# EAGLE design VeloPuter (EAGLE 8.5.0)
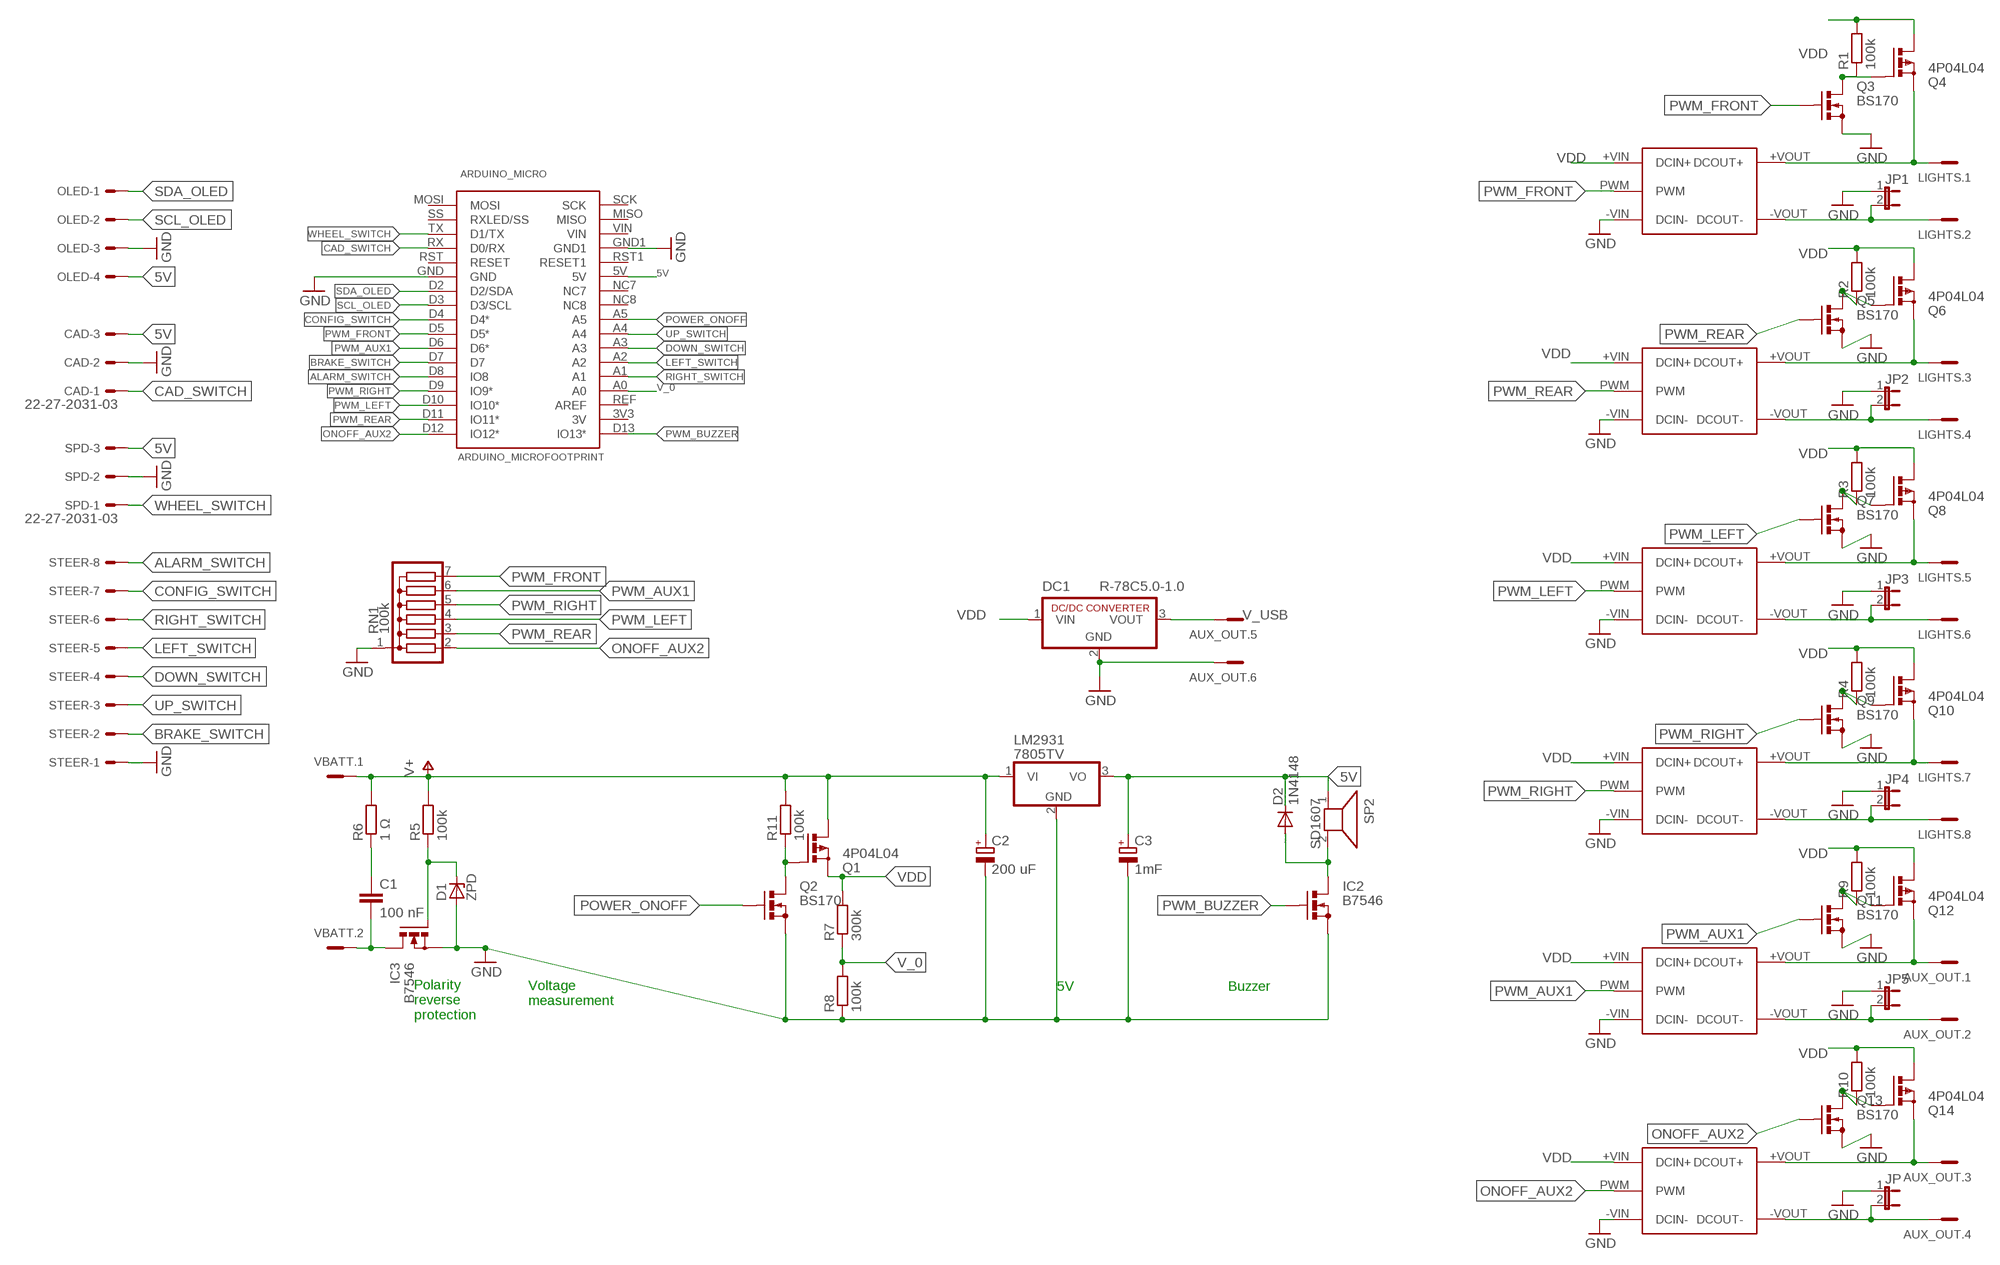
[diagram p0: schematic, sheet 1]

## Parts
ARDUINO_MICRO  ARDUINO_MICROFOOTPRINT  [ARDUINO-MICRO]
AUX_OUT  Aux  MCV6  [MCV6]
BRAKE  LDD-L  [LDD-L]
C1  100 nF  C2,5-3  [C2.5-3]
C2  200 uF  CPOL-EUE5-10.5  [E5-10,5]
C3  1mF  CPOL-EUE5-10.5  [E5-10,5]
CAD  22-27-2031-03  [6410-03]
D1  ZPD  [DO35Z10]
D2  1N4148  1N4148DO35-7  [DO35-7]
DC1  R-78C5.0-1.0  [SIP3]
IC2  B7546  BS170  [SOT54E]
IC3  B7546  PMOSFET_NTO220BV  [TO220BV]
JP  JP1E  [JP1]
JP1  JP1E  [JP1]
JP2  JP1E  [JP1]
JP3  JP1E  [JP1]
JP4  JP1E  [JP1]
JP5  JP1E  [JP1]
LIGHTS  Lights  MCV8  [MCV8]
LM2931  7805TV  [TO220V]
OLED  22-27-2041-04  [6410-04]
Q1  4P04L04  PMOSFET_PTO220BV  [TO220BV]
Q2  BS170  [SOT54E]
Q3  BS170  [SOT54E]
Q4  4P04L04  PMOSFET_PTO220BV  [TO220BV]
Q5  BS170  [SOT54E]
Q6  4P04L04  PMOSFET_PTO220BV  [TO220BV]
Q7  BS170  [SOT54E]
Q8  4P04L04  PMOSFET_PTO220BV  [TO220BV]
Q9  BS170  [SOT54E]
Q10  4P04L04  PMOSFET_PTO220BV  [TO220BV]
Q11  BS170  [SOT54E]
Q12  4P04L04  PMOSFET_PTO220BV  [TO220BV]
Q13  BS170  [SOT54E]
Q14  4P04L04  PMOSFET_PTO220BV  [TO220BV]
R1  100k  R-EU_0207/10  [0207/10]
R2  100k  R-EU_0207/10  [0207/10]
R3  100k  R-EU_0207/10  [0207/10]
R4  100k  R-EU_0207/10  [0207/10]
R5  100k  R-EU_0207/10  [0207/10]
R6  1 Ω  R-EU_0207/10  [0207/10]
R7  300k  R-EU_0207/10  [0207/10]
R8  100k  R-EU_0207/10  [0207/10]
R9  100k  R-EU_0207/10  [0207/10]
R10  100k  R-EU_0207/10  [0207/10]
R11  100k  R-EU_0207/10  [0207/10]
RN1  100k  G06R  [SIL7]
SP2  SD1607  AL60P  [AL60P]
SPD  22-27-2031-03  [6410-03]
STEER  22-27-2081-08  [6410-08]
U$1  LDD-L  [LDD-L]
U$2  LDD-L  [LDD-L]
U$3  LDD-L  [LDD-L]
U$4  LDD-L  [LDD-L]
U$5  LDD-L  [LDD-L]
VBATT  MCV2  [MCV2]

## Nets
5V: ARDUINO_MICRO.5V C3.+ CAD.3 D2.C LM2931.3(VO) OLED.4 SP2.1 SPD.3
ALARM_SWITCH: ARDUINO_MICRO.D8(IO8) STEER.8
AUX1+: AUX_OUT.1 Q12.S U$5.+VOUT(DCOUT+)
AUX1-: AUX_OUT.2 JP5.2 U$5.-VOUT(DCOUT-)
AUX2+: AUX_OUT.3 Q14.S U$1.+VOUT(DCOUT+)
AUX2-: AUX_OUT.4 JP.2 U$1.-VOUT(DCOUT-)
BRAKE_SWITCH: ARDUINO_MICRO.D7 STEER.2
CAD_SWITCH: ARDUINO_MICRO.RX(D0/RX) CAD.1
CONFIG_SWITCH: ARDUINO_MICRO.D4(D4*) STEER.7
DOWN_SWITCH: ARDUINO_MICRO.A3 STEER.4
FRONT+: LIGHTS.1 Q4.S U$4.+VOUT(DCOUT+)
FRONT-: JP1.2 LIGHTS.2 U$4.-VOUT(DCOUT-)
GND: ARDUINO_MICRO.GND ARDUINO_MICRO.GND1 AUX_OUT.6 BRAKE.-VIN(DCIN-) C2.- C3.- CAD.2 D1.A DC1.2(GND) IC2.S IC3.S JP1.1 JP2.1 JP3.1 JP4.1 JP5.1 JP.1 LM2931.2(GND) OLED.3 Q2.S Q3.S Q5.S Q7.S Q9.S Q11.S Q13.S R8.1 RN1.1 SPD.2 STEER.1 U$1.-VIN(DCIN-) U$2.-VIN(DCIN-) U$3.-VIN(DCIN-) U$4.-VIN(DCIN-) U$5.-VIN(DCIN-)
LEFT+: LIGHTS.5 Q8.S U$2.+VOUT(DCOUT+)
LEFT-: JP3.2 LIGHTS.6 U$2.-VOUT(DCOUT-)
LEFT_SWITCH: ARDUINO_MICRO.A2 STEER.5
N$1: C1.1 R6.1
N$4: D1.C IC3.G R5.1
N$14: D2.A IC2.D SP2.2
N$15: Q1.G Q2.D R11.1
N$17: Q3.D Q4.G R1.1
N$20: Q5.D Q6.G R2.1
N$23: Q7.D Q8.G R3.1
N$28: Q9.D Q10.G R4.1
N$33: Q11.D Q12.G R9.1
N$40: Q13.D Q14.G R10.1
ONOFF_AUX2: ARDUINO_MICRO.D12(IO12*) Q13.G RN1.2 U$1.PWM
POWER_ONOFF: ARDUINO_MICRO.A5 Q2.G
PWM_AUX1: ARDUINO_MICRO.D6(D6*) Q11.G RN1.6 U$5.PWM
PWM_BUZZER: ARDUINO_MICRO.D13(IO13*) IC2.G
PWM_FRONT: ARDUINO_MICRO.D5(D5*) Q3.G RN1.7 U$4.PWM
PWM_LEFT: ARDUINO_MICRO.D10(IO10*) Q7.G RN1.4 U$2.PWM
PWM_REAR: ARDUINO_MICRO.D11(IO11*) BRAKE.PWM Q5.G RN1.3
PWM_RIGHT: ARDUINO_MICRO.D9(IO9*) Q9.G RN1.5 U$3.PWM
REAR+: BRAKE.+VOUT(DCOUT+) LIGHTS.3 Q6.S
REAR-: BRAKE.-VOUT(DCOUT-) JP2.2 LIGHTS.4
RIGHT+: LIGHTS.7 Q10.S U$3.+VOUT(DCOUT+)
RIGHT-: JP4.2 LIGHTS.8 U$3.-VOUT(DCOUT-)
RIGHT_SWITCH: ARDUINO_MICRO.A1 STEER.6
SCL_OLED: ARDUINO_MICRO.D3(D3/SCL) OLED.2
SDA_OLED: ARDUINO_MICRO.D2(D2/SDA) OLED.1
UP_SWITCH: ARDUINO_MICRO.A4 STEER.3
V+: C2.+ LM2931.1(VI) Q1.D R5.2 R6.2 R11.2 VBATT.1
V-: C1.2 IC3.D VBATT.2
V_0: ARDUINO_MICRO.A0 R7.1 R8.2
V_USB: AUX_OUT.5 DC1.3(VOUT)
VDD: BRAKE.+VIN(DCIN+) DC1.1(VIN) Q1.S Q4.D Q6.D Q8.D Q10.D Q12.D Q14.D R1.2 R2.2 R3.2 R4.2 R7.2 R9.2 R10.2 U$1.+VIN(DCIN+) U$2.+VIN(DCIN+) U$3.+VIN(DCIN+) U$4.+VIN(DCIN+) U$5.+VIN(DCIN+)
WHEEL_SWITCH: ARDUINO_MICRO.TX(D1/TX) SPD.1
Unconnected: ARDUINO_MICRO.3V3(3V) ARDUINO_MICRO.MISO ARDUINO_MICRO.MOSI ARDUINO_MICRO.NC7 ARDUINO_MICRO.NC8 ARDUINO_MICRO.REF(AREF) ARDUINO_MICRO.RST1(RESET1) ARDUINO_MICRO.RST(RESET) ARDUINO_MICRO.SCK ARDUINO_MICRO.SS(RXLED/SS) ARDUINO_MICRO.VIN

## Notes on the sheet
- 5V | Buzzer
- Voltage
  measurement
- Polarity 
  reverse 
  protection

## Library data of the parts
ARDUINO_MICRO = arduino-micro_gbeu:ARDUINO_MICRO; OC_NEWARK: unknown
AUX_OUT = con-phoenix_3.81_mcv:MCV6: Mini-Combicon 3.81mm vertikal 6polig (ohne Gegenstecker)
BRAKE U$1-U$5 = meanwell_dcdc:LDD-L; OC_NEWARK: unknown
C1 = capacitor-wima:C: CAPACITOR naming: grid - package width; OC_NEWARK: unknown
C2 = rcl:CPOL-EU: POLARIZED CAPACITOR, European symbol; OC_NEWARK: unknown
C3 = resistor:CPOL-EU: POLARIZED CAPACITOR, European symbol; OC_NEWARK: unknown
CAD SPD = con-molex:22-?-03: CONNECTOR wire to board 2.54 mm (.1 inch) pitch header; OC_FARNELL: unknown; OC_NEWARK: unknown
D1 = diode:ZPD: Z DIODE 500 mW; OC_NEWARK: unknown
D2 = diode:1N4148: DIODE high speed (Philips); OC_NEWARK: unknown
DC1 = dc-dc-converter:R-78C*-1.0: INNOLINE DC/DC-Converter 1.0 AMP SIP3 Single Output Source: Data sheet <http://www.mikrocontroller.net/attachment/150645/157764-da-01-en-DC_DC_WANDLER_R_78C5_0_1_0.pdf>
IC2 = transistor-small-signal:BS170: N-CHANNEL MOS FET; OC_NEWARK: unknown
IC3 = transistor-power:PMOSFET_N: Power MOSFET N-Channel; OC_NEWARK: unknown
JP JP1-JP5 = jumper:JP1E: JUMPER
LIGHTS = con-phoenix_3.81_mcv:MCV8: Mini-Combicon 3.81mm vertikal 8polig (ohne Gegenstecker)
LM2931 = linear:78*: Positive VOLTAGE REGULATOR Source: http://cache.national.com/ds/LM/LM78L05.pdf http://www.fairchildsemi.com/ds/LM/LM7805.pdf
OLED = con-molex:22-?-04: CONNECTOR wire to board 2.54 mm (.1 inch) pitch header; OC_FARNELL: unknown; OC_NEWARK: unknown
Q1 Q4 Q6 Q8 Q10 Q12 Q14 = transistor-power:PMOSFET_P: Power MOSFET P-Channel
Q2 Q3 Q5 Q7 Q9 Q11 Q13 = transistor-small-signal:BS170: N-CHANNEL MOS FET
R1-R11 = resistor:R-EU_: RESISTOR, European symbol; OC_NEWARK: unknown
RN1 = resistor-sil:G06R: SIL RESISTOR; OC_FARNELL: unknown; OC_NEWARK: unknown
SP2 = TDK_SD1607:AL60P: SPEAKER Source: Buerklin
STEER = con-molex:22-?-08: CONNECTOR wire to board 2.54 mm (.1 inch) pitch header; OC_FARNELL: unknown; OC_NEWARK: unknown
VBATT = con-phoenix_3.81_mcv:MCV2: Mini-Combicon 3.81mm vertikal 2polig (ohne Gegenstecker)

## Net classes
0 default: width 0.305 mm, drill 0.508 mm, clearance 0.254 mm

## Board
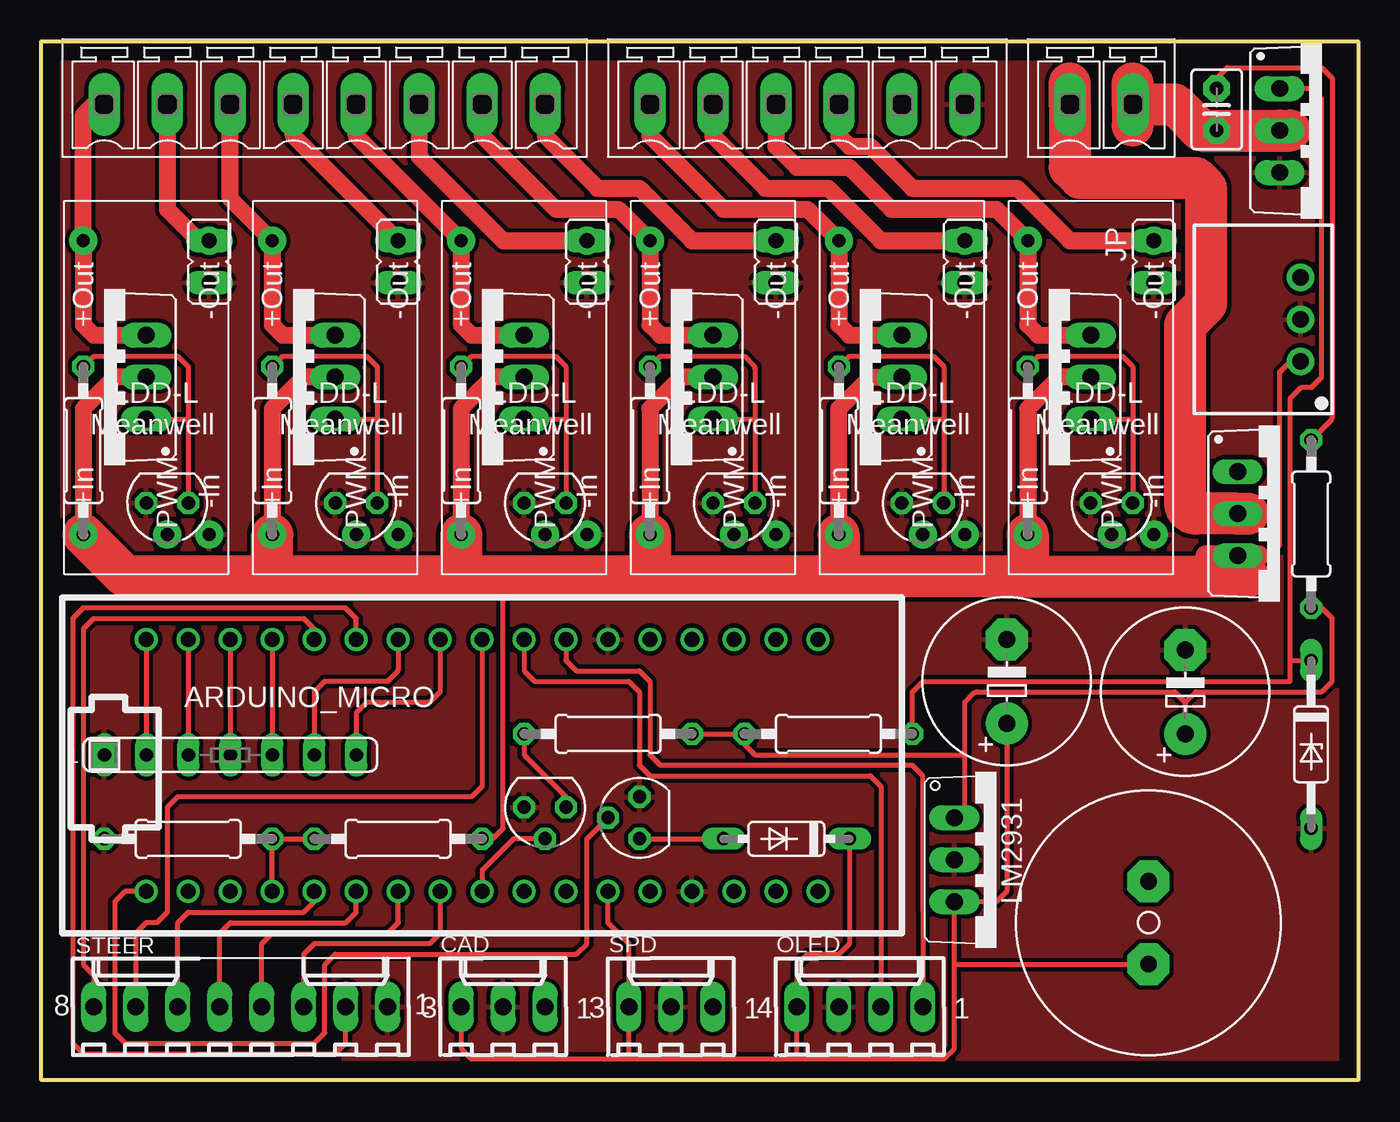
[diagram p1: board, top side]
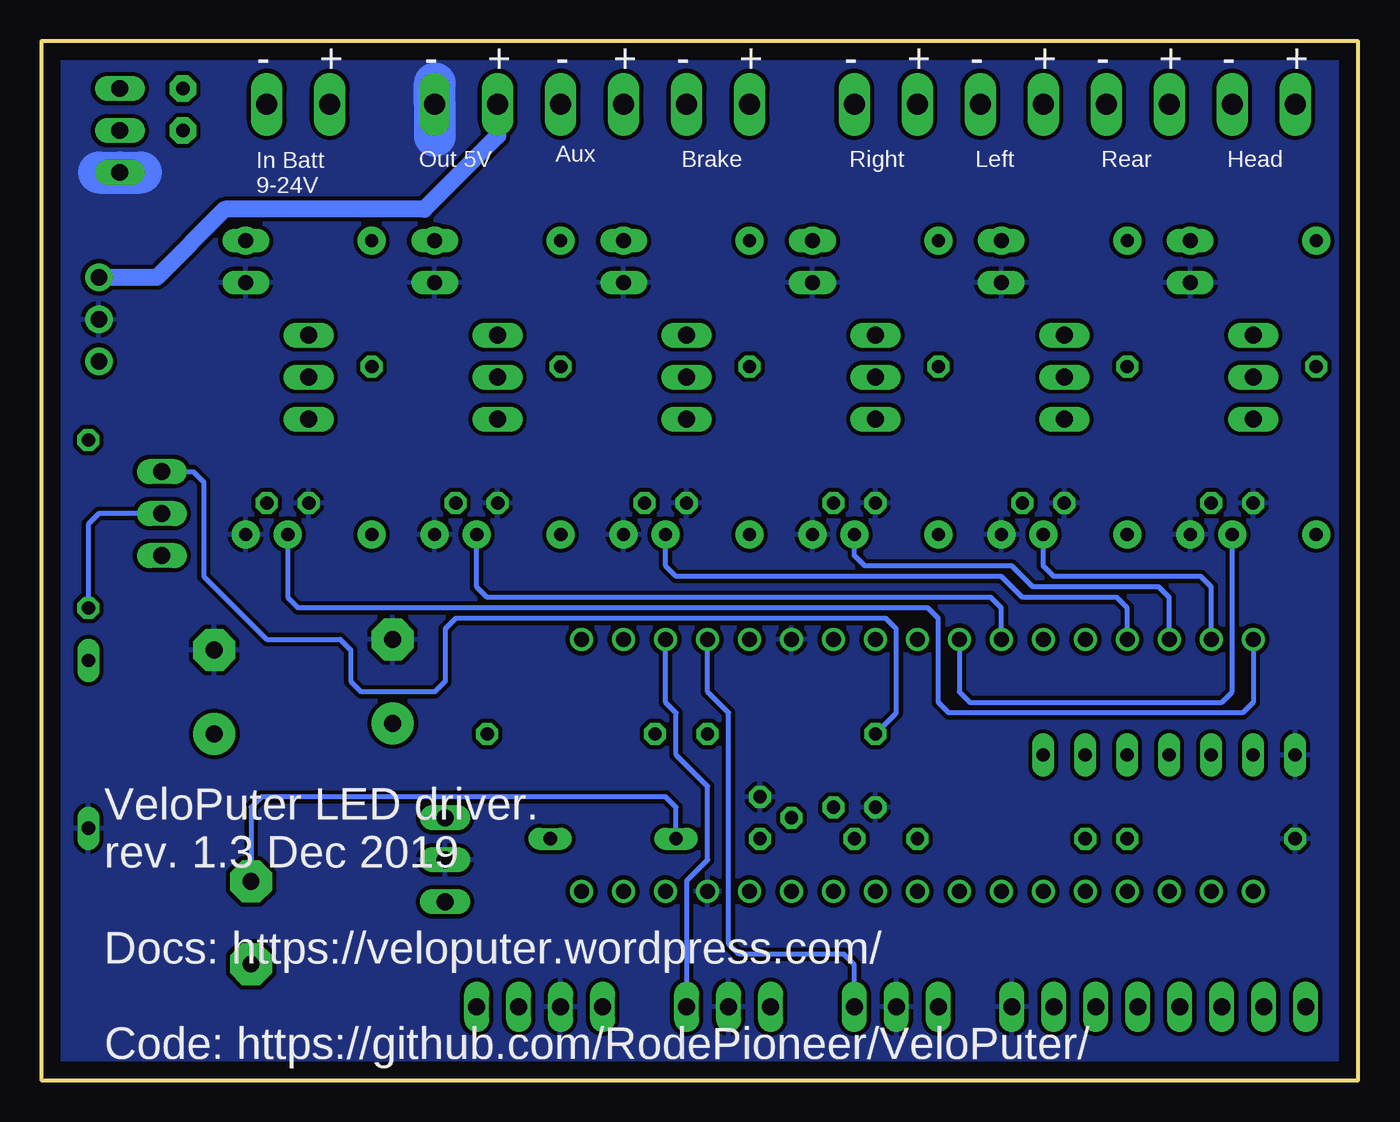
[diagram p2: board, bottom side, seen from below]

Size 79.68 x 62.85 mm. Coordinates in mm from the lower left corner, seen from the top.
Outline: 0,0 0,62.85 79.68,62.85 79.68,0 0,0
Copper layers (1*16): Top 0.035mm / dielectric 1.5mm / Bottom 0.035mm
Design rules "velomobiel_verlichting *": minimum track width 10mil, minimum drill 24mil, track to track 0.205mm, track to pad 0.205mm, pad to pad 0.205mm, via to via 0.205mm, smd to smd 8mil, copper to edge 40mil, drill to drill 8mil, minimum pad ring 10mil, minimum via ring 8mil, stop-mask expansion 4mil, vias tented up to drill 0mil, thermal gap 10mil

### Footprints (pad centres in the part's own frame; a part is rotated, then mirrored left to right if it is on the bottom)
ARDUINO-MICRO = drill 0.9: 3V3 16.51,3.81; 5V 16.51,29.21; A0 16.51,8.89; A1 16.51,11.43; A2 16.51,13.97; A3 16.51,16.51; A4 16.51,19.05; A5 16.51,21.59; D2 1.27,26.67; D3 1.27,24.13; D4 1.27,21.59; D5 1.27,19.05; D6 1.27,16.51; D7 1.27,13.97; D8 1.27,11.43; D9 1.27,8.89; D10 1.27,6.35; D11 1.27,3.81; D12 1.27,1.27; D13 16.51,1.27; GND 1.27,29.21; GND1 16.51,34.29; MISO 16.51,39.37; MOSI 1.27,41.91; NC7 16.51,26.67; NC8 16.51,24.13; REF 16.51,6.35; RST 1.27,31.75; RST1 16.51,31.75; RX 1.27,34.29; SCK 16.51,41.91; SS 1.27,39.37; TX 1.27,36.83; VIN 16.51,36.83
MCV6 = drill 1.27 pad 1.905 long: 1 -9.525,0; 2 -5.715,0; 3 -1.905,0; 4 1.905,0; 5 5.715,0; 6 9.525,0
LDD-L = drill 0.8 pad 1.676: +VIN 3.81,8.89; +VOUT 3.81,-8.89; -VIN -3.81,8.89; -VOUT -3.81,-8.89; PWM -1.27,8.89
C2.5-3 = drill 0.813 pad 1.6 octagon: 1 -1.27,0; 2 1.27,0
E5-10,5 = drill 1.016 pad 2.54: + -2.54,0 | drill 1.016 pad 2.54 octagon: - 2.54,0
6410-03 = drill 1.016 long: 1 2.54,0; 2 0,0; 3 -2.54,0
DO35Z10 = drill 0.813 long: A 5.08,0; C -5.08,0
DO35-7 = drill 0.813 long: A 3.81,0; C -3.81,0
SIP3 = drill 1 pad 1.676: 1 -2.54,0; 2 0,0; 3 2.54,0
SOT54E = drill 0.813 octagon: D -1.27,0; G 0,1.905; S 1.27,0
TO220BV = drill 1.016 long: D 0,-2.54; G -2.54,-2.54; S 2.54,-2.54
JP1 = drill 0.914 long: 1 0,-1.27; 2 0,1.27
MCV8 = drill 1.27 pad 1.905 long: 1 -13.335,0; 2 -9.525,0; 3 -5.715,0; 4 -1.905,0; 5 1.905,0; 6 5.715,0; 7 9.525,0; 8 13.335,0
TO220V = drill 1.016 long: 1 -2.54,-2.54; 2 0,-2.54; 3 2.54,-2.54
6410-04 = drill 1.016 long: 1 3.81,0; 2 1.27,0; 3 -1.27,0; 4 -3.81,0
0207/10 = drill 0.813 octagon: 1 -5.08,0; 2 5.08,0
SIL7 = drill 0.813 long: 1 -7.62,0; 2 -5.08,0; 3 -2.54,0; 4 0,0; 5 2.54,0; 6 5.08,0; 7 7.62,0
AL60P = drill 1.016 pad 2.54 octagon: 1 -2.5,0; 2 2.5,0
6410-08 = drill 1.016 long: 1 8.89,0; 2 6.35,0; 3 3.81,0; 4 1.27,0; 5 -1.27,0; 6 -3.81,0; 7 -6.35,0; 8 -8.89,0
MCV2 = drill 1.27 pad 1.905 long: 1 -1.905,0; 2 1.905,0

### Placement (x,y rotation side)
ARDUINO_MICRO  5.08,27.94 270 top
AUX_OUT  46.35,59.05 0 top
BRAKE  17.78,41.91 180 top
C1  71.12,58.74 270 top
C2  69.22,23.49 90 top
C3  58.42,24.13 90 top
CAD  27.94,4.45 0 top
D1  76.84,20.32 270 top
D2  45.09,14.61 180 top
DC1  76.2,46.04 90 top
IC2  36.2,15.88 90 top
IC3  77.47,57.47 270 top
JP  67.31,49.53 0 top
JP1  10.16,49.53 0 top
JP2  21.59,49.53 0 top
JP3  33.02,49.53 0 top
JP4  44.45,49.53 0 top
JP5  55.88,49.53 0 top
LIGHTS  17.15,59.05 0 top
LM2931  57.78,13.34 270 top
OLED  49.53,4.45 0 top
Q1  74.93,34.29 270 top
Q2  30.48,16.51 180 top
Q3  7.62,34.92 180 top
Q4  3.81,42.55 90 top
Q5  19.05,34.92 180 top
Q6  15.24,42.55 90 top
Q7  30.48,34.92 180 top
Q8  26.67,42.55 90 top
Q9  41.91,34.92 180 top
Q10  38.1,42.55 90 top
Q11  53.34,34.92 180 top
Q12  49.53,42.55 90 top
Q13  64.77,34.92 180 top
Q14  60.96,42.55 90 top
R1  2.54,38.1 270 top
R2  13.97,38.1 270 top
R3  25.4,38.1 270 top
R4  36.83,38.1 270 top
R5  47.62,20.95 180 top
R6  76.84,33.66 270 top
R7  21.59,14.61 0 top
R8  8.89,14.61 0 top
R9  48.26,38.1 270 top
R10  59.69,38.1 270 top
R11  34.29,20.95 0 top
RN1  11.43,19.68 0 top
SP2  66.99,9.53 90 top
SPD  38.1,4.45 0 top
STEER  12.06,4.45 0 top
U$1  63.5,41.91 180 top
U$2  29.21,41.91 180 top
U$3  40.64,41.91 180 top
U$4  6.35,41.91 180 top
U$5  52.07,41.91 180 top
VBATT  64.14,59.05 0 top

### Tracks (layer width: path | path; a pad name or v marks a point on that pad's centre or on a via)
5V
  Top 0.305: CAD.3 25.4,1.91 26.01,1.29 35.56,1.29 | 35.56,1.29 SPD.3 35.56,8.25 34.29,9.53 ARDUINO_MICRO.5V | 45.72,1.29 OLED.4 45.72,6.99 46.35,7.62 48.26,7.62 48.89,8.25 D2.C | 35.56,1.29 45.72,1.29 | 45.72,1.29 54.61,1.29 arc45 54.65,1.31 55.24,1.91 55.24,6.99 | 55.24,6.99 LM2931.3 57.78,10.8 58.42,11.43 C3.+ | SP2.1 arc-45 66.58,6.99 55.24,6.99
ALARM_SWITCH
  Top 0.305: ARDUINO_MICRO.D8 16.51,27.3 15.88,27.94 3.17,27.94 2.54,27.3 2.54,6.99 3.17,6.35 STEER.8
AUX1+
  Top 1.016: Q12.S 48.89,45.09 48.26,45.72 U$5.+VOUT 46.35,52.7 41.27,52.7 36.83,57.15 AUX_OUT.1
AUX1-
  Top 1.016: AUX_OUT.2 40.64,57.15 43.81,53.98 47.62,53.98 50.8,50.8 JP5.2
AUX2+
  Top 1.016: Q14.S 60.32,45.09 59.69,45.72 U$1.+VOUT 57.78,52.7 51.43,52.7 48.89,55.24 45.72,55.24 44.45,56.52 AUX_OUT.3
AUX2-
  Top 1.016: AUX_OUT.4 48.26,57.15 48.89,56.52 50.16,56.52 52.7,53.98 59.05,53.98 62.23,50.8 JP.2
BRAKE_SWITCH
  Top 0.305: ARDUINO_MICRO.D7 19.05,27.94 18.42,28.57 2.54,28.57 1.91,27.94 1.91,2.22 2.54,1.59 17.78,1.59 18.42,2.22 STEER.2
CAD_SWITCH
  Bottom 0.305: CAD.1 30.48,6.99 31.12,7.62 37.46,7.62 38.1,8.25 38.1,22.22 39.37,23.49 ARDUINO_MICRO.RX
CONFIG_SWITCH
  Top 0.305: ARDUINO_MICRO.D4 26.67,17.78 26.04,17.14 8.26,17.14 7.62,16.51 7.62,10.16 6.98,9.53 6.35,9.53 5.71,8.89 STEER.7
DOWN_SWITCH
  Top 0.305: STEER.4 13.33,8.25 13.97,8.89 20.96,8.89 21.59,9.53 ARDUINO_MICRO.A3
FRONT+
  Top 1.016: Q4.S 3.17,45.09 2.54,45.72 U$4.+VOUT 2.54,58.42 3.17,59.05 LIGHTS.1
FRONT-
  Top 1.016: LIGHTS.2 7.62,52.7 9.53,50.8 JP1.2
GND
  Bottom 2.54: 55.88,60.32 AUX_OUT.6 55.88,57.15 | 76.2,54.93 IC3.S 73.66,54.93
  pour Bottom: 0,0 0,62.87 79.69,62.87 79.38,0
  pour Top: 0,0 0,62.87 79.38,62.87 79.38,0
LEFT+
  Top 1.016: LIGHTS.5 19.05,57.15 U$2.+VOUT 25.4,45.72 26.04,45.09 Q8.S
LEFT-
  Top 1.016: LIGHTS.6 22.86,55.88 27.94,50.8 JP3.2
LEFT_SWITCH
  Top 0.305: STEER.5 10.79,8.89 11.43,9.53 18.42,9.53 19.05,10.16 ARDUINO_MICRO.A2
N$1
  Top 0.305: R6.1 78.03,39.93 arc45 78.11,40.11 78.11,60.64 77.47,61.28 71.76,61.28 71.12,60.64 C1.1
N$4
  Top 0.305: 75.57,25.4 D1.C | R5.1 52.7,23.49 53.34,24.13 75.57,24.13 75.57,25.4 | IC3.G 76.84,60.01 77.47,59.37 77.47,42.55 76.84,41.91 76.2,41.91 75.57,41.27 75.57,25.4
N$14
  Top 0.305: IC2.D D2.A
  Bottom 0.305: SP2.2 66.99,16.51 66.36,17.14 41.91,17.14 41.27,16.51 D2.A
N$15
  Top 0.305: R11.1 29.21,19.68 31.75,17.14 Q2.D
  Bottom 0.305: R11.1 28.01,22.15 arc-45 27.94,22.33 27.94,27.3 28.58,27.94 54.61,27.94 55.24,27.3 55.24,24.13 55.88,23.49 60.32,23.49 60.96,24.13 60.96,26.04 61.59,26.67 66.04,26.67 69.85,30.48 69.85,36.2 70.48,36.83 Q1.G
N$17
  Top 0.305: R1.1 3.17,43.81 8.26,43.81 8.89,43.18 8.89,40.01 | 8.89,40.01 Q3.D | Q4.G 8.89,40.01
N$20
  Top 0.305: R2.1 14.61,43.81 19.69,43.81 20.32,43.18 20.32,40.01 | 20.32,40.01 Q5.D | Q6.G 20.32,40.01
N$23
  Top 0.305: R3.1 26.04,43.81 31.12,43.81 31.75,43.18 31.75,40.01 | 31.75,40.01 Q7.D | Q8.G 31.75,40.01
N$28
  Top 0.305: R4.1 37.46,43.81 42.54,43.81 43.11,43.25 arc-45 43.18,43.07 43.18,40.01 | 43.18,40.01 Q9.D | Q10.G 43.18,40.01
N$33
  Top 0.305: R9.1 48.89,43.81 53.98,43.81 54.61,43.18 54.61,40.01 | 54.61,40.01 Q11.D | Q12.G 54.61,40.01
N$40
  Top 0.305: R10.1 60.32,43.81 65.41,43.81 66.04,43.18 66.04,40.01 | 66.04,40.01 Q13.D | Q14.G 66.04,40.01
ONOFF_AUX2
  Top 0.305: ARDUINO_MICRO.D12 RN1.2
  Bottom 0.305: Q13.G 64.77,29.21 64.14,28.57 26.04,28.57 25.4,27.94 25.4,22.86 24.77,22.22 6.98,22.22 6.35,22.86 ARDUINO_MICRO.D12
POWER_ONOFF
  Top 0.305: Q2.G 28.58,14.61 26.67,12.7 ARDUINO_MICRO.A5
PWM_AUX1
  Top 0.305: RN1.6 16.51,23.49 17.15,24.13 20.96,24.13 21.52,24.69 arc45 21.59,24.87 ARDUINO_MICRO.D6
  Bottom 0.305: ARDUINO_MICRO.D6 21.59,28.57 22.23,29.21 52.7,29.21 53.34,29.84 Q11.G
PWM_BUZZER
  Top 0.305: ARDUINO_MICRO.D13 5.08,11.43 4.45,10.8 4.45,2.86 5.08,2.22 16.51,2.22 17.15,2.86 17.15,6.99 17.78,7.62 32.28,7.62 arc45 32.46,7.69 33.02,8.25 33.02,14.61 IC2.G
PWM_FRONT
  Top 0.305: ARDUINO_MICRO.D5 24.13,23.49 23.5,22.86 19.69,22.86 19.05,22.22 RN1.7
  Bottom 0.305: ARDUINO_MICRO.D5 24.13,23.49 23.5,22.86 8.26,22.86 7.62,23.49 Q3.G
PWM_LEFT
  Top 0.305: ARDUINO_MICRO.D10 RN1.4
  Bottom 0.305: ARDUINO_MICRO.D10 11.43,29.21 12.06,29.84 19.69,29.84 20.96,31.11 29.85,31.11 30.48,31.75 Q7.G
PWM_REAR
  Top 0.305: ARDUINO_MICRO.D11 RN1.3
  Bottom 0.305: ARDUINO_MICRO.D11 8.89,29.84 9.53,30.48 18.42,30.48 19.05,31.11 Q5.G
PWM_RIGHT
  Top 0.305: ARDUINO_MICRO.D9 RN1.5
  Bottom 0.305: ARDUINO_MICRO.D9 13.97,28.57 14.61,29.21 20.32,29.21 21.59,30.48 41.27,30.48 41.91,31.11 Q9.G
REAR+
  Top 1.016: LIGHTS.3 11.43,53.34 BRAKE.+VOUT 13.97,45.82 arc45 14.04,45.65 14.61,45.09 Q6.S
REAR-
  Top 1.016: JP2.2 15.24,57.15 LIGHTS.4
RIGHT+
  Top 1.016: Q10.S 37.46,45.09 36.83,45.72 U$3.+VOUT 34.92,52.7 31.22,52.7 arc-45 31.04,52.78 26.67,57.15 LIGHTS.7
RIGHT-
  Top 1.016: LIGHTS.8 30.48,57.15 33.66,53.98 | 33.66,53.98 | 33.66,53.98 arc45 33.66,53.98 | 33.66,53.98 36.2,53.98 39.37,50.8 JP4.2
RIGHT_SWITCH
  Top 0.305: STEER.6 8.26,9.53 8.89,10.16 15.88,10.16 16.51,10.8 ARDUINO_MICRO.A1
SCL_OLED
  Top 0.305: ARDUINO_MICRO.D3 29.21,24.77 29.85,24.13 35.56,24.13 36.2,23.49 36.2,19.05 36.83,18.41 50.16,18.41 50.8,17.78 OLED.2
SDA_OLED
  Top 0.305: ARDUINO_MICRO.D2 31.75,25.4 32.38,24.77 36.2,24.77 36.83,24.13 36.83,19.68 37.46,19.05 39.37,19.05 52.7,19.05 53.34,18.41 53.34,16.38 53.31,16.36 53.31,10.31 53.34,10.29 OLED.1
UP_SWITCH
  Top 0.305: ARDUINO_MICRO.A4 24.13,8.89 23.5,8.25 16.51,8.25 15.88,7.62 STEER.3
V+
  Top 0.305: R11.2 R5.2 42.54,20.32 43.18,19.68 55.88,19.68 | LM2931.1 55.81,16.44 arc45 55.88,16.61 55.88,19.68 | 55.88,19.68 55.88,22.86 56.44,23.42 arc-45 56.62,23.49 68.58,23.49 69.14,22.93 arc-45 69.22,22.75 | C2.+ 69.22,22.75 | 69.22,22.75 arc-45 69.29,22.93 69.85,23.49 77.47,23.49 78.11,24.13 78.11,27.94 77.47,28.57 R6.2
  Top 2.54: 69.85,34.29 69.22,34.92 | 69.22,34.92 69.22,45.72 70.48,46.99 70.48,53.98 69.85,54.61 62.86,54.61 62.23,55.24 VBATT.1 62.23,60.32 | 69.22,34.92 arc90 69.85,34.29 | 69.85,34.29 Q1.D 73.03,34.29
  Bottom 0.305: Q1.D 76.2,34.29 76.84,33.66 R6.2
V-
  Top 0.305: IC3.D C1.2
  Top 2.54: VBATT.2 68.58,59.05 70.17,57.47 IC3.D 75.57,57.47 | VBATT.2 66.04,60.32 | VBATT.2 66.04,57.78
V_0
  Top 0.305: ARDUINO_MICRO.A0 R8.2 R7.1
V_USB
  Bottom 1.016: AUX_OUT.5 52.07,57.15 56.52,52.7 68.58,52.7 72.71,48.58 DC1.3
VDD
  Top 0.305: 27.94,30.48 27.94,15.24 27.31,14.61 R7.2 | DC1.1 75.57,43.5 74.93,42.86 74.93,32.38 74.3,31.75 73.66,31.75
  Top 1.016: Q14.D 61.59,42.55 59.69,40.64 R10.2 | Q12.D 50.16,42.55 48.26,40.64 R9.2 | Q10.D 38.73,42.55 36.83,40.64 R4.2 | Q8.D 27.31,42.55 25.4,40.64 R3.2 | Q6.D 15.88,42.55 13.97,40.64 R2.2 | Q4.D 4.45,42.55 2.54,40.64 R1.2
  Top 1.27: 72.39,30.48 Q1.S | 70.48,31.75 Q1.S | Q1.S 73.66,31.75
  Top 2.54: 59.69,30.48 48.26,30.48 | 48.26,30.48 36.83,30.48 | 36.83,30.48 27.94,30.48 25.4,30.48 | 25.4,30.48 13.97,30.48 | 13.97,30.48 5.08,30.48 R1.2 | R3.2 25.4,30.48 | R4.2 36.83,30.48 | R9.2 48.26,30.48 | R10.2 59.69,30.48 | 13.97,30.48 R2.2 | 59.69,30.48 72.39,30.48 73.03,30.48
WHEEL_SWITCH
  Bottom 0.305: ARDUINO_MICRO.TX 41.91,22.86 41.27,22.22 41.27,19.68 39.37,17.78 39.37,13.34 40.64,12.07 SPD.1

### Text on the board
bNames: + | - | + | - | + | - | + | - | + | - | + | - | + | - | + | - | In Batt / 9-24V | Head | Rear | Left | Right | Brake | Aux | Out 5V | VeloPuter LED driver. / rev. 1.3 Dec 2019 / / Docs: https://veloputer.wordpress.com/ / / Code: https://github.com/RodePioneer/VeloPuter/
tValues: - | +